# EasyEDA Pro project ProPrj_多功能方向盘_2025-05-18.epro, schematic Schematic1
Board Name: Board1; Create Date: 2025-04-27; Page Name: P1; Project Name: 多功能方向盘; Schematic Name: Schematic1; Update Date: 2025-04-27; Company: 嘉立创EDA; Page Size: A4; Version: V1.0
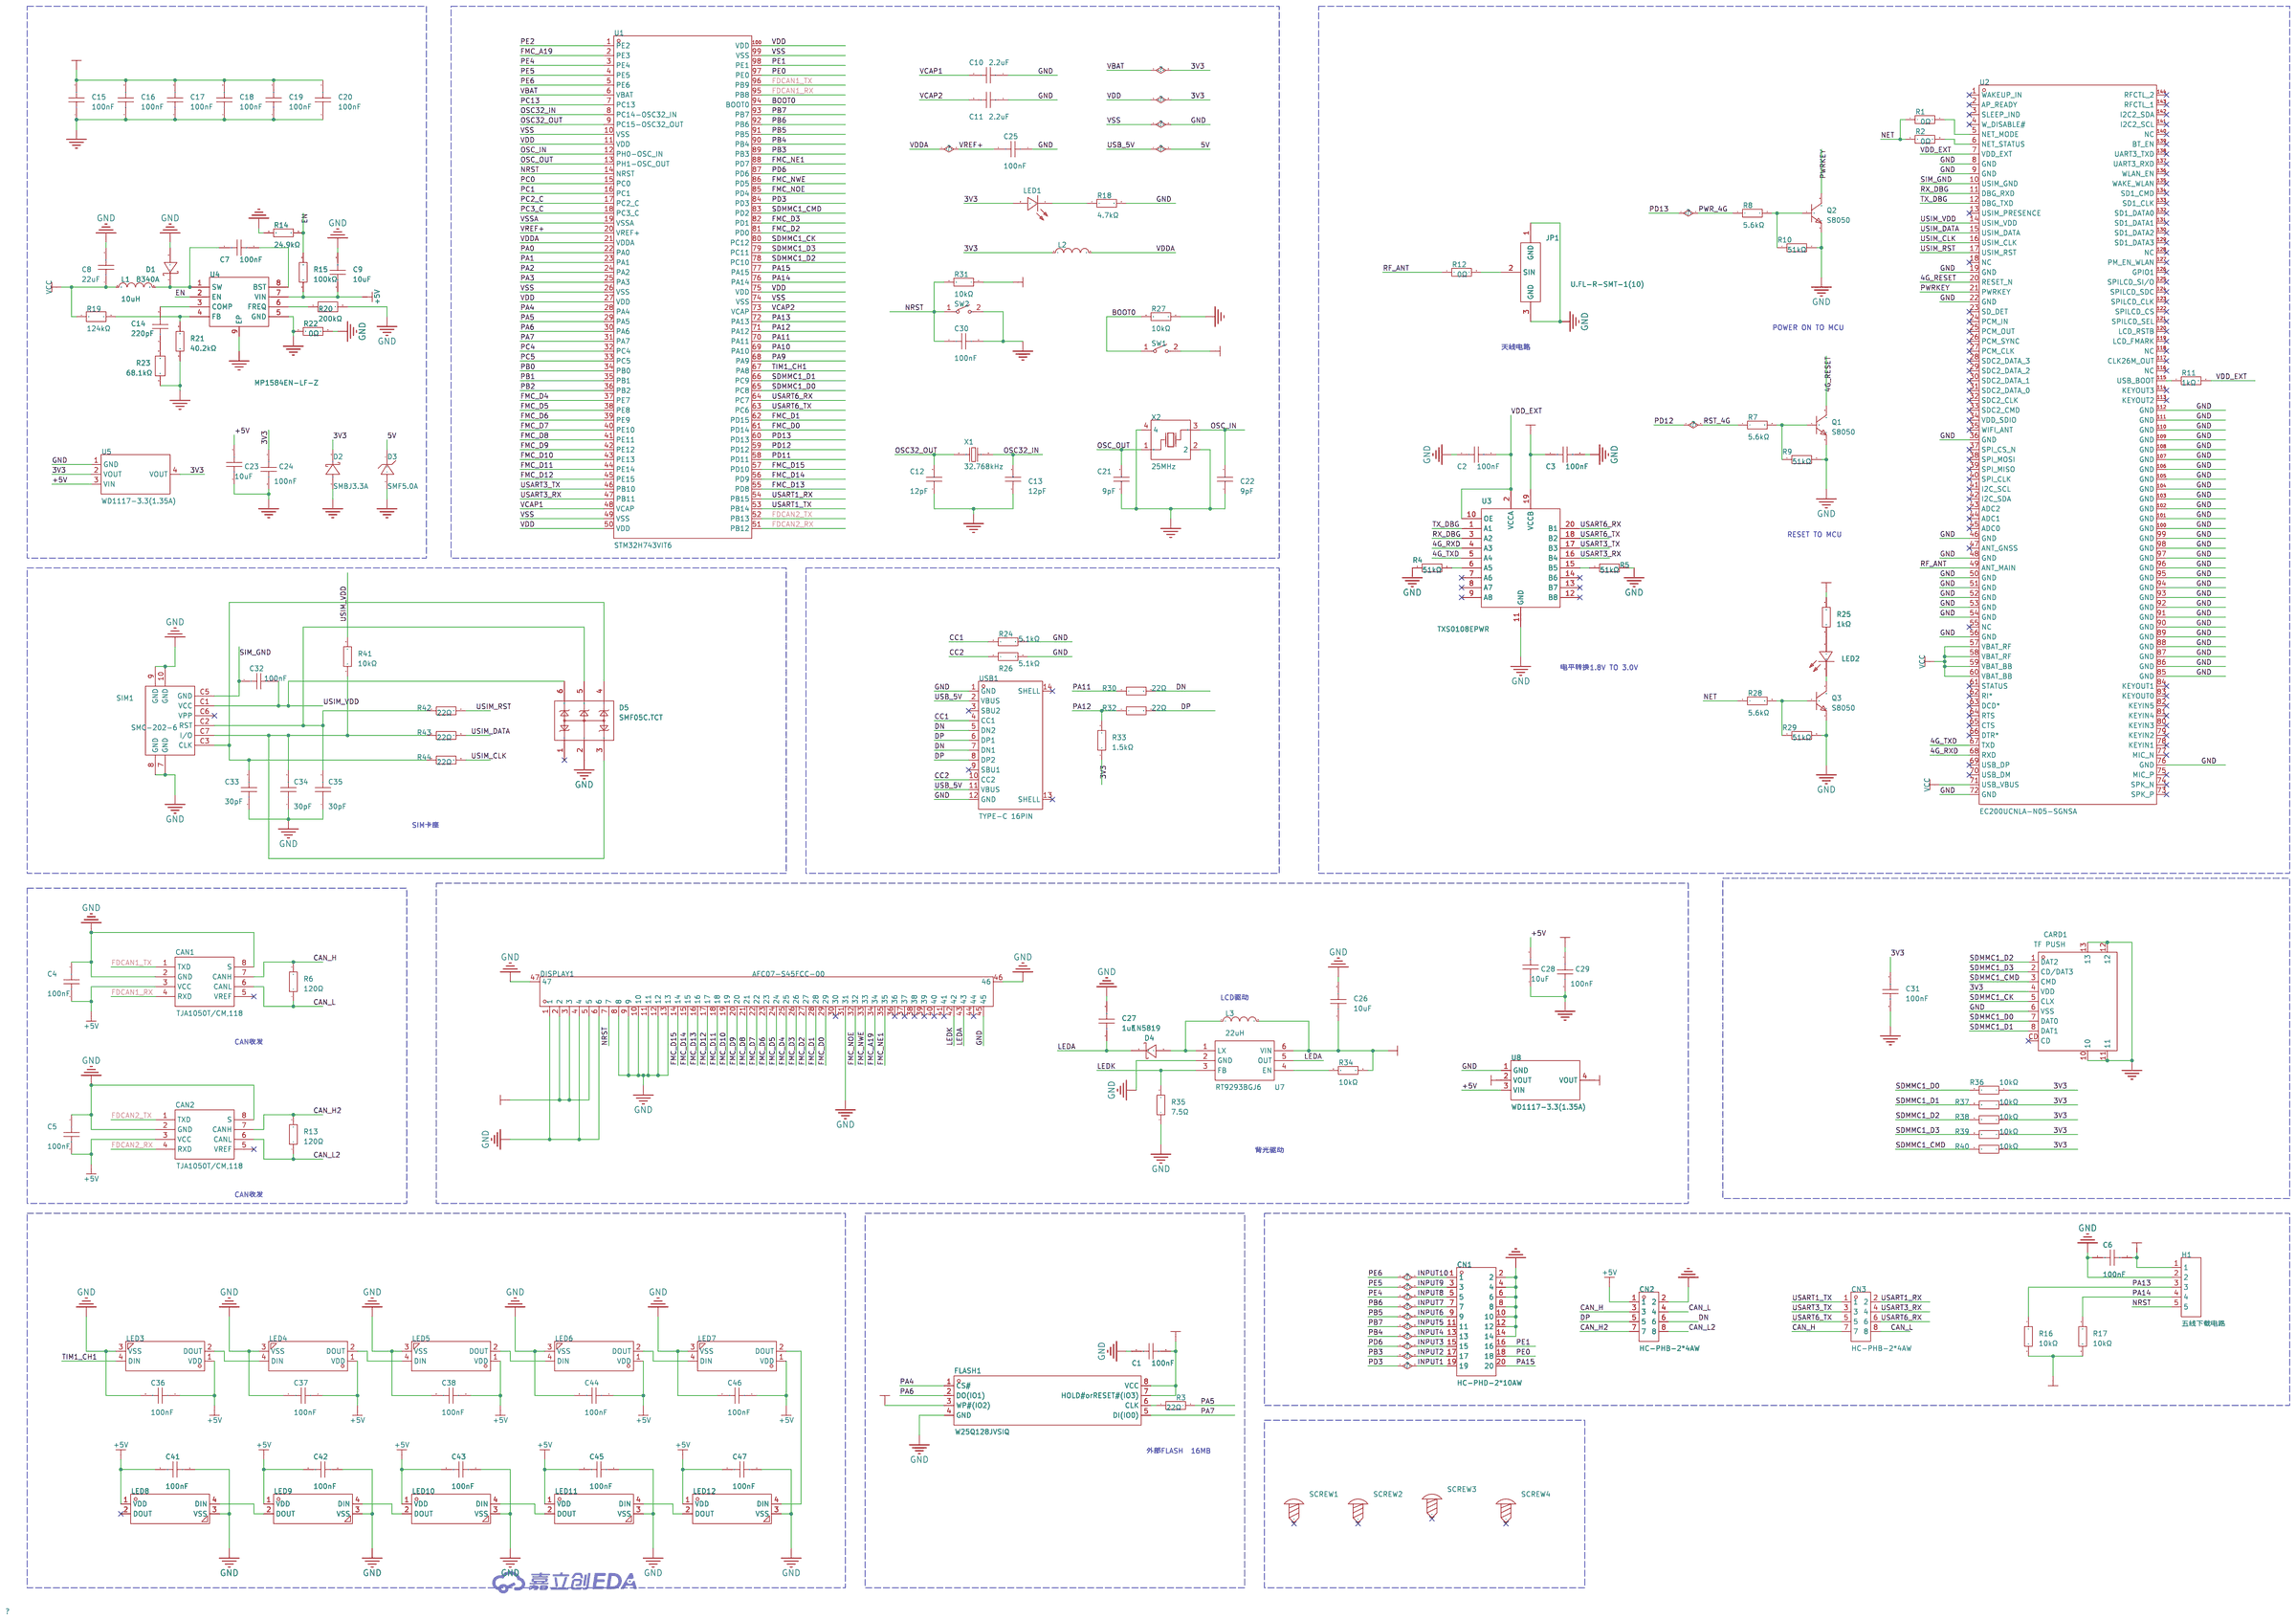
[diagram p0: schematic sheet]

## Parts
C1  100nF  [C0402]
C2  100nF  [C0402]
C3  100nF  [C0402]
C4  100nF  [C0402]
C5  100nF  [C0402]
C6  100nF  [C0402]
C7  100nF  [C0402]
C8  22uF  [C0603]
C9  10uF  [C0603]
C10  2.2uF  [C0402]
C11  2.2uF  [C0402]
C12  12pF  [C0402]
C13  12pF  [C0402]
C14  220pF  [C0402]
C15  100nF  [C0402]
C16  100nF  [C0402]
C17  100nF  [C0402]
C18  100nF  [C0402]
C19  100nF  [C0402]
C20  100nF  [C0402]
C21  9pF  [C0402]
C22  9pF  [C0402]
C23  10uF  [C0603]
C24  100nF  [C0402]
C25  100nF  [C0402]
C26  10uF  [C0603]
C27  1uF  [C0402]
C28  10uF  [C0603]
C29  100nF  [C0402]
C30  100nF  [C0402]
C31  100nF  [C0402]
C32  100nF  [C0402]
C33  30pF  [C0402]
C34  30pF  [C0402]
C35  30pF  [C0402]
C36  100nF  [C0402]
C37  100nF  [C0402]
C38  100nF  [C0402]
C41  100nF  [C0402]
C42  100nF  [C0402]
C43  100nF  [C0402]
C44  100nF  [C0402]
C45  100nF  [C0402]
C46  100nF  [C0402]
C47  100nF  [C0402]
CAN1  TJA1050T/CM,118  [SOIC-8_L5.0-W4.0-P1.27-LS6.0-BL]
CAN2  TJA1050T/CM,118  [SOIC-8_L5.0-W4.0-P1.27-LS6.0-BL]
CARD1  TF PUSH  [TF-SMD_TF-PUSH]
CN1  HC-PHD-2*10AW  [CONN-TH_20P-P2.00_HCTL_HC-PHD]
CN2  HC-PHB-2*4AW  [CONN-TH_8P-P2.00_HCTL_HC-PHB-2X4AW]
CN3  HC-PHB-2*4AW  [CONN-TH_8P-P2.00_HCTL_HC-PHB-2X4AW]
D1  B340A  [SMA_L4.3-W2.6-LS5.1-RD]
D2  SMBJ3.3A  [SMB_L4.4-W3.6-LS5.3-R-RD]
D3  SMF5.0A  [SOD-123FL_L2.8-W1.9-LS3.7-RD]
D4  1N5819  [SMA_L4.4-W2.6-LS5.0-RD]
D5  SMF05C.TCT  [SC-70-6_L2.2-W1.3-P0.65-LS2.1-BR]
DISPLAY1  AFC07-S45FCC-00  [FPC-SMD_45P-P0.50_SLIDE-LOCK-BOTTOM-CONTACT]
FLASH1  W25Q128JVSIQ  [SOIC-8_L5.3-W5.3-P1.27-LS8.0-BL]
H1  五线下载电路  [HDR-TH_5P-P2.00-H-M_2005WR-5P]
JP1  U.FL-R-SMT-1(10)  [ANT-SMD_UFL-R-SMT-1-10]
L1  10uH  [IND-SMD_L4.0-W4.0]
L2  BLM15PD121SN1D  [L0402]
L3  22uH  [IND-SMD_L5.0-W5.0_H4.0]
LED1  NCD0402R1  [LED0402-RD]
LED2  NCD0402R1  [LED0402-RD]
LED3  WS2812B-B  [LED-SMD_4P-L5.0-W5.0-TL_WS2812B-B]
LED4  WS2812B-B  [LED-SMD_4P-L5.0-W5.0-TL_WS2812B-B]
LED5  WS2812B-B  [LED-SMD_4P-L5.0-W5.0-TL_WS2812B-B]
LED6  WS2812B-B  [LED-SMD_4P-L5.0-W5.0-TL_WS2812B-B]
LED7  WS2812B-B  [LED-SMD_4P-L5.0-W5.0-TL_WS2812B-B]
LED8  WS2812B-B  [LED-SMD_4P-L5.0-W5.0-TL_WS2812B-B]
LED9  WS2812B-B  [LED-SMD_4P-L5.0-W5.0-TL_WS2812B-B]
LED10  WS2812B-B  [LED-SMD_4P-L5.0-W5.0-TL_WS2812B-B]
LED11  WS2812B-B  [LED-SMD_4P-L5.0-W5.0-TL_WS2812B-B]
LED12  WS2812B-B  [LED-SMD_4P-L5.0-W5.0-TL_WS2812B-B]
Q1  S8050  [SOT-23-3_L2.9-W1.3-P1.90-LS2.4-BR]
Q2  S8050  [SOT-23-3_L2.9-W1.3-P1.90-LS2.4-BR]
Q3  S8050  [SOT-23-3_L2.9-W1.3-P1.90-LS2.4-BR]
R1  0Ω  [R0402]
R2  0Ω  [R0402]
R3  22Ω  [R0402]
R4  51kΩ  [R0402]
R5  51kΩ  [R0402]
R6  120Ω  [R0402]
R7  5.6kΩ  [R0402]
R8  5.6kΩ  [R0402]
R9  51kΩ  [R0402]
R10  51kΩ  [R0402]
R11  1kΩ  [R0402]
R12  0Ω  [R0402]
R13  120Ω  [R0402]
R14  24.9kΩ  [R0402]
R15  100kΩ  [R0402]
R16  10kΩ  [R0402]
R17  10kΩ  [R0402]
R18  4.7kΩ  [R0402]
R19  124kΩ  [R0402]
R20  200kΩ  [R0402]
R21  40.2kΩ  [R0402]
R22  0Ω  [R0402]
R23  68.1kΩ  [R0402]
R24  5.1kΩ  [R0402]
R25  1kΩ  [R0402]
R26  5.1kΩ  [R0402]
R27  10kΩ  [R0402]
R28  5.6kΩ  [R0402]
R29  51kΩ  [R0402]
R30  22Ω  [R0402]
R31  10kΩ  [R0402]
R32  22Ω  [R0402]
R33  1.5kΩ  [R0402]
R34  10kΩ  [R0402]
R35  7.5Ω  [R0402]
R36  10kΩ  [R0402]
R37  10kΩ  [R0402]
R38  10kΩ  [R0402]
R39  10kΩ  [R0402]
R40  10kΩ  [R0402]
R41  10kΩ  [R0402]
R42  22Ω  [R0402]
R43  22Ω  [R0402]
R44  22Ω  [R0402]
SCREW1  -  [M3螺丝]
SCREW2  -  [M3螺丝]
SCREW3  -  [M3螺丝]
SCREW4  -  [M3螺丝]
SIM1  SMC-202-6  [SIM-SMD_SMC-202-6]
SW1  TS-1088R-02026  [SW-SMD_L3.9-W3.0-P4.45]
SW2  TS-1088R-02026  [SW-SMD_L3.9-W3.0-P4.45]
U1  STM32H743VIT6  [LQFP-100_L14.0-W14.0-P0.50-LS16.0-BL]
U2  EC200UCNLA-N05-SGNSA  [LCC-LGA-144_L31.0-W28.0-P1.30_L610-CN-02]
U3  TXS0108EPWR  [TSSOP-20_L6.5-W4.4-P0.65-LS6.4-BL]
U4  MP1584EN-LF-Z  [SOIC-8_L5.0-W4.0-P1.27-LS6.0-BL-EP2.0]
U5  WD1117-3.3(1.35A)  [SOT-223-3_L6.5-W3.4-P2.30-LS7.0-BR]
U7  -  [SOT-23-6_L2.9-W1.6-P0.95-LS2.8-BR]
U8  WD1117-3.3(1.35A)  [SOT-223-3_L6.5-W3.4-P2.30-LS7.0-BR]
USB1  TYPE-C 16PIN  [USB-C-SMD_TYPE-C-6PIN-2MD-073]
X1  32.768kHz  [FC-135R_L3.2-W1.5]
X2  25MHz  [CRYSTAL-SMD_4P-L3.2-W2.5-BL]

## Library data of the parts
C1-C7 C15-C20 C24 C25 C29-C32 C36-C38 C41-C47 = CL05B104KO5NNNC: 容值:100nF;精度:±10%;额定电压:16V;材质(温度系数):X7R;; LCSC Part Name: 100nF ±10% 16V; Supplier Part: C1525; Manufacturer: SAMSUNG(三星); Supplier Footprint: 0402; JLCPCB Part Class: 基础库; Datasheet: https://atta.szlcsc.com/upload/public/pdf/source/20160218/1457707763339.pdf; Supplier: LCSC; Tolerance: ±10%; Voltage Rated: 16V; Temperature Coefficient: X7R
C8 = CGA0603X5R226M160JT: 容值:22uF;精度:±20%;额定电压:16V;材质(温度系数):X5R;; LCSC Part Name: 22uF ±20% 16V; Supplier Part: C6119868; Manufacturer: HRE(芯声); Supplier Footprint: 0603; JLCPCB Part Class: 扩展库; Supplier: LCSC; Tolerance: ±20%; Voltage Rated: 16V; Temperature Coefficient: X5R
C9 C23 C26 C28 = CGA0603X5R106K100JT: 容值:10uF;精度:±10%;额定电压:10V;材质(温度系数):X5R;; LCSC Part Name: 10uF ±10% 10V; Supplier Part: C6119842; Manufacturer: HRE(芯声); Supplier Footprint: 0603; JLCPCB Part Class: 扩展库; Supplier: LCSC; Tolerance: ±10%; Voltage Rated: 10V; Temperature Coefficient: X5R
C10 C11 = CL05A225KO5NQNC: 容值:2.2uF;精度:±10%;额定电压:16V;材质(温度系数):X5R;; LCSC Part Name: 2.2uF ±10% 16V; Supplier Part: C170151; Manufacturer: SAMSUNG(三星); Supplier Footprint: 0402; JLCPCB Part Class: 扩展库; Datasheet: https://atta.szlcsc.com/upload/public/pdf/source/20160218/1457707763339.pdf; Supplier: LCSC; Tolerance: ±10%; Voltage Rated: 16V; Temperature Coefficient: X5R
C12 C13 = GRM1555C1H120JA01D: 容值:12pF;精度:±5%;额定电压:50V;材质(温度系数):C0G;; LCSC Part Name: 12pF ±5% 50V; Supplier Part: C76948; Manufacturer: muRata(村田); Supplier Footprint: 0402; JLCPCB Part Class: 扩展库; Datasheet: https://atta.szlcsc.com/upload/public/pdf/source/20180307/C76948_15204091175261407736.pdf; Supplier: LCSC; Tolerance: ±5%; Voltage Rated: 50V; Temperature Coefficient: C0G
C14 = GRM1555C1H221JA01D: 容值:220pF;精度:±5%;额定电压:50V;材质(温度系数):C0G;; LCSC Part Name: 220pF ±5% 50V; Supplier Part: C71693; Manufacturer: muRata(村田); Supplier Footprint: 0402; JLCPCB Part Class: 扩展库; Datasheet: https://atta.szlcsc.com/upload/public/pdf/source/20161108/1478586451181.pdf; Supplier: LCSC; Tolerance: ±5%; Voltage Rated: 50V; Temperature Coefficient: C0G
C21 C22 = 0402CG9R0C500NT: 容值:9pF;额定电压:50V;温度系数:C0G;; LCSC Part Name: ±0.25pF 9pF 50V; Supplier Part: C1580; Manufacturer: FH(风华); Supplier Footprint: 0402; JLCPCB Part Class: 扩展库; Datasheet: https://atta.szlcsc.com/upload/public/pdf/source/20200305/C486355_26A10D38EF8C2A5C37091D0039909270.pdf; Supplier: LCSC; Voltage Rating: 50V; Temperature Coefficient: C0G
C27 = CL05A105KA5NQNC: 容值:1uF;精度:±10%;额定电压:25V;材质(温度系数):X5R;; LCSC Part Name: 1uF ±10% 25V; Supplier Part: C52923; Manufacturer: SAMSUNG(三星); Supplier Footprint: 0402; JLCPCB Part Class: 基础库; Datasheet: https://atta.szlcsc.com/upload/public/pdf/source/20160218/1457707763339.pdf; Supplier: LCSC; Tolerance: ±10%; Voltage Rated: 25V; Temperature Coefficient: X5R
C33-C35 = GCQ1555C1H300JB01D: 容值:30pF;精度:±5%;额定电压:50V;材质(温度系数):-;; LCSC Part Name: 30pF ±5% 50V; Supplier Part: C2186903; Manufacturer: muRata(村田); Supplier Footprint: 0402; JLCPCB Part Class: 扩展库; Datasheet: https://atta.szlcsc.com/upload/public/pdf/source/20210612/66FBFE1CC3D0A6F34E2515C814489E64.pdf; Supplier: LCSC; Tolerance: ±5%; Voltage Rated: 50V
CAN1 CAN2 = TJA1050T/CM,118: 类型:收发器;协议类别:CAN总线;; Supplier Part: C6952; Manufacturer: NXP(恩智浦); Supplier Footprint: SOIC-8_150mil; JLCPCB Part Class: Basic Part; Datasheet: https://atta.szlcsc.com/upload/public/pdf/source/20140411/1457707042917.pdf; Supplier: LCSC; Type: 收发器; Protocol: CAN总线; Supply Voltage: 4.75V ~ 5.25V
CARD1 = TF PUSH: 卡连接方式:自弹式;卡类型:MicroSD卡(TF卡);连接器类型:卡座;本体最大高度:2mm;工作温度范围:-20℃~+90℃;; LCSC Part Name: 自弹式 MicroSD卡(TF卡) 卡座; Supplier Part: C393941; Manufacturer: SHOU HAN(首韩); Supplier Footprint: SMD; JLCPCB Part Class: 扩展库; Datasheet: https://atta.szlcsc.com/upload/public/pdf/source/20191011/C393941_0DDD896EE907FEB750D8B7B8982E2A67.pdf; Supplier: LCSC; Card Connection Mode: 自弹式; Card Type: MicroSD卡(TF卡); Connector Type: 卡座; Maximum Body Height: 2mm; Operating Temperature Range: -20℃~+90℃
CN1 = HC-PHD-2*10AW: 插针结构:2x10P;间距:2mm;安装方式:弯插;参考系列:PHD;总PIN数:20P;排数:2;每排PIN数:10;行距:2mm;额定电流:3A;触头材质:黄铜;触头镀层:锡;工作温度范围:-25℃~+85℃;; LCSC Part Name: 2x10P 间距:2mm 弯插 系列:PHD; Supplier Part: C2845639; Manufacturer: HCTL(华灿天禄); Supplier Footprint: 弯插,P=2mm; JLCPCB Part Class: 扩展库; Datasheet: https://atta.szlcsc.com/upload/public/pdf/source/20240826/7E3B459B81463944AEE37CAD48063E32.pdf; Supplier: LCSC; Pins Structure: 2x10P; Pitch: 2mm; Mounting Style: 弯插; Reference Series: PHD; Number of Pins: 20P; Number of Rows: 2; Number of PINs Per Row: 10; Row Spacing: 2mm; Current Rating (Max): 3A; Contact Material: 黄铜; Contact Plating: 锡; Operating Temperature Range: -25℃~+85℃; Rated Voltage (Max): 250V; Plastic Material: PA46; Z-Height of the Board: 5.2mm; X-Length of Bottom Edge on Board (Spacing Line): 22mm; Y-Width of Bottom Edge on Board: 9.5mm
CN2 CN3 = HC-PHB-2*4AW: 插针结构:2x4P;间距:2mm;安装方式:弯插;参考系列:-;总PIN数:8P;排数:2;每排PIN数:4;行距:2mm;额定电流:2A;触头材质:黄铜;触头镀层:锡;工作温度范围:-40℃~+105℃;; LCSC Part Name: 2x4P 间距:2mm 弯插; Supplier Part: C2845898; Manufacturer: HCTL(华灿天禄); Supplier Footprint: 弯插,P=2mm; JLCPCB Part Class: 扩展库; Datasheet: https://atta.szlcsc.com/upload/public/pdf/source/20241107/C3FDF6F4E6440F0C633ABF41B12F454C.pdf; Supplier: LCSC; Pins Structure: 2x4P; Pitch: 2mm; Mounting Style: 弯插; Number of Pins: 8P; Number of Rows: 2; Number of PINs Per Row: 4; Row Spacing: 2mm; Current Rating (Max): 2A; Contact Material: 黄铜; Contact Plating: 锡; Operating Temperature Range: -40℃~+105℃; Rated Voltage (Max): 250V; Plastic Material: PA66; Z-Height of the Board: 7.3mm; X-Length of Bottom Edge on Board (Spacing Line): 10mm
D1 = B340A: 二极管配置:独立式;正向压降(Vf):550mV@3A;直流反向耐压(Vr):40V;整流电流:3A;; LCSC Part Name: 电压:40V 电流:3A; Supplier Part: C64982; Manufacturer: MDD(辰达半导体); Supplier Footprint: SMA(DO-214AC); JLCPCB Part Class: 扩展库; Datasheet: https://atta.szlcsc.com/upload/public/pdf/source/20240710/591710C3B34CDB7FE3DA92C119E6F598.pdf; Supplier: LCSC; Diode Configuration: 独立式; Forward Voltage (Vf@If): 550mV@3A; Reverse Voltage (Vr): 40V; Rectified Current: 3A; Reverse Leakage Current (Ir): 500uA@40V
D2 = SMBJ24A_C726830: 极性：单向 反向截止电压(Vrwm)：24V 击穿电压：26.7V 最大钳位电压：38.9V; LCSC Part Name: SMBJ24A; Supplier Part: C726830; Manufacturer: TWGMC(台湾迪嘉); Supplier Footprint: SMB; JLCPCB Part Class: 扩展库; Datasheet: https://atta.szlcsc.com/upload/public/pdf/source/20200901/C726811_07201DC3516E92FF13903A0BAE18F725.pdf; Supplier: LCSC
D3 = SMF5.0A_C2857263: 反向截止电压(Vrwm):5V;最大钳位电压:9.2V;峰值脉冲电流(Ipp)@10/1000us:21.7A;击穿电压:6.4V;; Supplier Part: C2857263; Manufacturer: JSMSEMI(杰盛微); Supplier Footprint: SOD-123FL; JLCPCB Part Class: 扩展库; Datasheet: https://atta.szlcsc.com/upload/public/pdf/source/20220120/4066B4D37095FB947F97BAEB950D8525.pdf; Supplier: LCSC; Reverse Stand-Off Voltage (Vrwm): 5V; Maximum Clamping Voltage: 9.2V; Peak Pulse Current (Ipp)@10/1000us: 21.7A; Breakdown Voltage: 6.4V; Reverse Leakage Current (Ir): 2uA
D4 = 1N5819: 直流反向耐压(Vr):40V;平均整流电流(Io):1A;正向压降(Vf):500mV@1A;; LCSC Part Name: 40V 1A 500mV@1A; Supplier Part: C437199; Manufacturer: KEXIN(科信); Supplier Footprint: SMA; JLCPCB Part Class: Extended Part; Datasheet: https://atta.szlcsc.com/upload/public/pdf/source/20191012/C437199_83583E622A6684E767605E43C169C596.pdf; Supplier: LCSC; Reverse Voltage (Vr): 40V; Average Rectified Current (Io): 1A; Forward Voltage (Vf@If): 500mV@1A
D5 = SMF05C.TCT: 反向截止电压(Vrwm):5V@Max;击穿电压(最小值):6V;最大钳位电压:12.5V;; LCSC Part Name: Vrwm：5V@Max; Supplier Part: C85191; Manufacturer: SEMTECH; Supplier Footprint: SC-70-6(SOT-363); JLCPCB Part Class: Extended Part; Datasheet: https://atta.szlcsc.com/upload/public/pdf/source/20170704/1499151379189.pdf; Supplier: LCSC; Reverse Stand-Off Voltage (Vrwm): 5V@Max; Breakdown Voltage (Min): 6V; Maximum Clamping Voltage: 12.5V
DISPLAY1 = AFC07-S45FCC-00: 间距:0.5mm;触点数量:45;锁定特性:抽屉式;安装类型:卧贴;触点类型:上接;; LCSC Part Name: 0.5mm P数:45 抽屉式 下接; Supplier Part: C53058; Manufacturer: JS(钜硕电子); Supplier Footprint: SMD,P=0.5mm; JLCPCB Part Class: Extended Part; Datasheet: https://atta.szlcsc.com/upload/public/pdf/source/20151024/1457707491270.pdf; Supplier: LCSC; Pitch: 0.5mm; Number of Contacts: 45; Locking Feature: 抽屉式; Mounting Type: 卧贴; Contact Type: 下接; Height Above Board: 2mm; FFC, FCB Thickness: 0.3mm
FLASH1 = W25Q128JVSIQ_C113767: Supplier Part: C113767; Manufacturer: WINBOND(华邦); Supplier Footprint: SOIC-8-208mil; JLCPCB Part Class: Extended Part; Datasheet: https://atta.szlcsc.com/upload/public/pdf/source/20180329/C113767_097B64D788F6E3FFB2E9CB46CB6C1427.pdf; Supplier: LCSC
H1 = HC-PZ200-10.5L-1x5PWA: 插针结构:1x5P;间距:2mm;行距:-;圆针/方针:方针;安装方式:弯插;排数:单排;总PIN位数:5P;额定电流:1.5A;额定电压:-;配合针长度:4mm;塑高:2mm;端接针长度:2.8mm;触头材质:黄铜;触头镀层:金;工作温度:-40℃~+105℃;颜色:黑色;; LCSC Part Name: 1x5P 间距:2mm 方针 弯插; Supplier Part: C22373834; Manufacturer: HC(虹成电子); Supplier Footprint: 弯插,P=2mm; JLCPCB Part Class: 扩展库; Datasheet: https://atta.szlcsc.com/upload/public/pdf/source/20250106/B188A63B8DBD12FDD50FFA8EDDC02E69.pdf; Supplier: LCSC; Pin Structure: 1x5P; Pitch: 2mm; Circluar Pins/Square Pins: 方针; Mounting Type: 弯插; Number of Rows: 单排; Number of Pins: 5P; Current Rating: 1.5A; Length of Mating Pin: 4mm; Insulation Height: 2mm; Length of End Connection Pin: 2.8mm; Contact Material: 黄铜; Contact Plating: 金; Operating Temperature: -40℃~+105℃; Color: 黑色
JP1 = U.FL-R-SMT-1(10): 连接器类型:板端;射频系列:IPEX;接口类型:内针;端口数量:1;阻抗:50Ω;频率-最大值:6GHz;样式:-;接口直径:2mm;接口长度/高度:1.25mm;工作温度范围:-40~+90;; LCSC Part Name: IPEX 内针; Supplier Part: C88373; Manufacturer: HRS(广濑); Supplier Footprint: SMD; JLCPCB Part Class: Extended Part; Datasheet: https://atta.szlcsc.com/upload/public/pdf/source/20170116/1484561244841.pdf; Supplier: LCSC; Connector Type: 板端; RF Series: IPEX; Interface Type: 内针; Number of Ports: 1; Impedance: 50Ω; Frequency-Max: 6GHz; Interface Diameter: 2mm; Interface Length/Height: 1.25mm; Operating Temperature Range: -40~+90
L1 = FHD4020S-100MT: 电感值:10uH;精度:±20%;额定电流:2.35A;饱和电流(Isat):3.5A;; LCSC Part Name: 10uH ±20% 3.5A; Supplier Part: C602032; Manufacturer: cjiang(长江微电); Supplier Footprint: SMD,4x4mm; JLCPCB Part Class: 扩展库; Datasheet: https://atta.szlcsc.com/upload/public/pdf/source/20200609/C601990_BCEA243EC4DA0A9A288AA78A6DFB48A5.pdf; Supplier: LCSC; Tolerance: ±20%; Rated Current: 2.35A; Saturation Current (Isat): 3.5A; DC Resistance (DCR): 190mΩ
L2 = BLM15PD121SN1D: 标称阻抗@测试频率:120Ω@100MHz;误差:±25%;直流电阻(RDC):90mΩ;; LCSC Part Name: 单路 0402磁珠 阻抗120Ω@100MHz; Supplier Part: C76891; Manufacturer: muRata(村田); Supplier Footprint: 0402; JLCPCB Part Class: 扩展库; Datasheet: https://atta.szlcsc.com/upload/public/pdf/source/20181120/C333978_3E581FB55966932B05020139ABDE8E01.pdf; Supplier: LCSC; Impedance @ Frequency: 120Ω@100MHz; Tolerance: ±25%; DC Resistance: 90mΩ; Current Rating: 1.3A; Circuits: 1
L3 = FNR5040S220MT: 电感值:22uH;精度:±20%;额定电流:1.6A;饱和电流(Isat):1.8A;类型:磁胶屏蔽绕线合金电感;; LCSC Part Name: 22uH ±20% 1.8A; Supplier Part: C167971; Manufacturer: cjiang(长江微电); Supplier Footprint: SMD,5x5mm; JLCPCB Part Class: 扩展库; Datasheet: https://atta.szlcsc.com/upload/public/pdf/source/20190327/C167925_9EFF0AABC4CA629C2CC95961DBF7D39D.pdf; Supplier: LCSC; Tolerance: ±20%; Current Rating: 1.6A; Current - Saturation(Isat): 1.8A; DC Resistance(DCR): 168mΩ; Type: 磁胶屏蔽绕线合金电感
LED1 LED2 = NCD0402R1: 发光颜色:红色;正向电压(VF):1.6V~2.6V;功率:65mW;正向电流:5mA;主波长:615nm~635nm;透镜颜色:无色透明透镜;发光强度:13mcd~30mcd;发光角度:130°;工作温度:-30℃~+85℃;; Supplier Part: C130719; Manufacturer: 国星光电; Supplier Footprint: 0402; JLCPCB Part Class: 扩展库; Datasheet: https://atta.szlcsc.com/upload/public/pdf/source/20200820/C130719_A72EA5A7FEC83C35856EA0453E4EE775.pdf; Supplier: LCSC; Emitted Color: 红色; Forward Voltage (VF): 1.6V~2.6V; Power Dissipation: 65mW; Forward Current: 5mA; Dominant Wavelength: 615nm~635nm; Lens Color: 无色透明透镜; Luminous Intensity: 13mcd~30mcd; Viewing Angle: 130°; Operating Temperature: -30℃~+85℃
LED3-LED12 = WS2812B-B: 发光颜色:RGB三色;; LCSC Part Name: RGB三色 （注意防潮，请查阅规格书中对应具体内容）; Supplier Part: C114586; Manufacturer: worldsemi; Supplier Footprint: 5050(mm); JLCPCB Part Class: Extended Part; Datasheet: https://atta.szlcsc.com/upload/public/pdf/source/20200615/C114586_26EB6813EC9F2A3F6C7FBB2AD75DE01F.pdf; Supplier: LCSC; Emitted Color: RGB三色
Q1-Q3 = S8050_C2891804: 晶体管类型:NPN;集电极电流(Ic):500mA;集射极击穿电压(Vceo):25V;耗散功率(Pd):300mW;直流电流增益(hFE):400@50mA,1V;; Supplier Part: C2891804; Manufacturer: YONGYUTAI(永裕泰); Supplier Footprint: SOT-23; JLCPCB Part Class: 扩展库; Datasheet: https://atta.szlcsc.com/upload/public/pdf/source/20210901/5347316A10609C628D4D69AE01446E5B.pdf; Supplier: LCSC; type: NPN; Current - Collector(Ic): 500mA; Collector - Emitter Voltage VCEO: 25V; Pd - Power Dissipation: 300mW; DC Current Gain: 400@50mA,1V; Current - Collector Cutoff: 1uA; Vce Saturation(VCE(sat)): 500mV
R1 R2 R12 R22 = 0402WGF0000TCE: 电阻类型:厚膜电阻;阻值:0Ω;精度:±1%;功率:62.5mW;最大工作电压:50V;温度系数:±800ppm/℃;; LCSC Part Name: 0Ω ±1% 62.5mW 厚膜电阻; Supplier Part: C17168; Manufacturer: UNI-ROYAL(厚声); Supplier Footprint: 0402; JLCPCB Part Class: 基础库; Datasheet: https://atta.szlcsc.com/upload/public/pdf/source/20200306/C422600_1E6D84923E4A46A82E41ADD87F860B5C.pdf; Supplier: LCSC; Type: 厚膜电阻; Tolerance: ±1%; Power(Watts): 62.5mW; Overload Voltage (Max): 50V; Temperature Coefficient: ±800ppm/℃; Operating Temperature Range: -55℃~+155℃
R3 R30 R32 R42-R44 = 0402WGF220JTCE: 电阻类型:厚膜电阻;阻值:22Ω;精度:±1%;功率:62.5mW;最大工作电压:50V;温度系数:±100ppm/℃;; LCSC Part Name: 22Ω ±1% 62.5mW 厚膜电阻; Supplier Part: C25092; Manufacturer: UNI-ROYAL(厚声); Supplier Footprint: 0402; JLCPCB Part Class: 基础库; Datasheet: https://atta.szlcsc.com/upload/public/pdf/source/20200306/C422600_1E6D84923E4A46A82E41ADD87F860B5C.pdf; Supplier: LCSC; Type: 厚膜电阻; Tolerance: ±1%; Power(Watts): 62.5mW; Overload Voltage (Max): 50V; Temperature Coefficient: ±100ppm/℃; Operating Temperature Range: -55℃~+155℃
R4 R5 R9 R10 R29 = 0402WGF5102TCE: 电阻类型:厚膜电阻;阻值:51kΩ;精度:±1%;功率:62.5mW;最大工作电压:50V;温度系数:±100ppm/℃;; LCSC Part Name: 51kΩ ±1% 62.5mW 厚膜电阻; Supplier Part: C25794; Manufacturer: UNI-ROYAL(厚声); Supplier Footprint: 0402; JLCPCB Part Class: 基础库; Datasheet: https://atta.szlcsc.com/upload/public/pdf/source/20200306/C422600_1E6D84923E4A46A82E41ADD87F860B5C.pdf; Supplier: LCSC; Type: 厚膜电阻; Tolerance: ±1%; Power(Watts): 62.5mW; Overload Voltage (Max): 50V; Temperature Coefficient: ±100ppm/℃; Operating Temperature Range: -55℃~+155℃
R6 R13 = RC0402FR-07120RL: 电阻类型:厚膜电阻;阻值:120Ω;精度:±1%;功率:62.5mW;最大工作电压:50V;温度系数:±100ppm/℃;; LCSC Part Name: 厚膜电阻 120Ω ±1% 62.5mW; Supplier Part: C114758; Manufacturer: YAGEO(国巨); Supplier Footprint: 0402; JLCPCB Part Class: 扩展库; Datasheet: https://atta.szlcsc.com/upload/public/pdf/source/20180821/C275644_0D56F95EFF785E7D9A1FEF436B37DA78.pdf; Supplier: LCSC; Type: 厚膜电阻; Tolerance: ±1%; Power(Watts): 62.5mW; Overload Voltage (Max): 50V; Temperature Coefficient: ±100ppm/℃; Operating Temperature Range: -55℃~+155℃
R7 R8 R28 = RC0402FR-075K6L: 电阻类型:厚膜电阻;阻值:5.6kΩ;精度:±1%;功率:62.5mW;最大工作电压:50V;温度系数:±100ppm/℃;; LCSC Part Name: 厚膜电阻 5.6kΩ ±1% 62.5mW; Supplier Part: C163457; Manufacturer: YAGEO(国巨); Supplier Footprint: 0402; JLCPCB Part Class: 扩展库; Datasheet: https://atta.szlcsc.com/upload/public/pdf/source/20181009/C309620_DA5935B6E1D48212CB7A533FE518B3C2.pdf; Supplier: LCSC; Type: 厚膜电阻; Tolerance: ±1%; Power(Watts): 62.5mW; Overload Voltage (Max): 50V; Temperature Coefficient: ±100ppm/℃; Operating Temperature Range: -55℃~+155℃
R11 R25 = 0402WGF1001TCE: 电阻类型:厚膜电阻;阻值:1kΩ;精度:±1%;功率:62.5mW;最大工作电压:50V;温度系数:±100ppm/℃;; LCSC Part Name: 1kΩ ±1% 62.5mW 厚膜电阻; Supplier Part: C11702; Manufacturer: UNI-ROYAL(厚声); Supplier Footprint: 0402; JLCPCB Part Class: 基础库; Datasheet: https://atta.szlcsc.com/upload/public/pdf/source/20200306/C422600_1E6D84923E4A46A82E41ADD87F860B5C.pdf; Supplier: LCSC; Type: 厚膜电阻; Tolerance: ±1%; Power(Watts): 62.5mW; Overload Voltage (Max): 50V; Temperature Coefficient: ±100ppm/℃; Operating Temperature Range: -55℃~+155℃
R14 = 0402WGF2492TCE: 电阻类型:厚膜电阻;阻值:24.9kΩ;精度:±1%;功率:62.5mW;最大工作电压:50V;温度系数:±100ppm/℃;; LCSC Part Name: 24.9kΩ ±1% 62.5mW 厚膜电阻; Supplier Part: C25874; Manufacturer: UNI-ROYAL(厚声); Supplier Footprint: 0402; JLCPCB Part Class: 扩展库; Datasheet: https://atta.szlcsc.com/upload/public/pdf/source/20200306/C422600_1E6D84923E4A46A82E41ADD87F860B5C.pdf; Supplier: LCSC; Type: 厚膜电阻; Tolerance: ±1%; Power(Watts): 62.5mW; Overload Voltage (Max): 50V; Temperature Coefficient: ±100ppm/℃; Operating Temperature Range: -55℃~+155℃
R15 = 0402WGF1003TCE: 电阻类型:厚膜电阻;阻值:100kΩ;精度:±1%;功率:62.5mW;最大工作电压:50V;温度系数:±100ppm/℃;; LCSC Part Name: 100kΩ ±1% 62.5mW 厚膜电阻; Supplier Part: C25741; Manufacturer: UNI-ROYAL(厚声); Supplier Footprint: 0402; JLCPCB Part Class: 基础库; Datasheet: https://atta.szlcsc.com/upload/public/pdf/source/20200306/C422600_1E6D84923E4A46A82E41ADD87F860B5C.pdf; Supplier: LCSC; Type: 厚膜电阻; Tolerance: ±1%; Power(Watts): 62.5mW; Overload Voltage (Max): 50V; Temperature Coefficient: ±100ppm/℃; Operating Temperature Range: -55℃~+155℃
R16 R17 R27 R31 R34 R36-R41 = 0402WGF1002TCE: 电阻类型:厚膜电阻;阻值:10kΩ;精度:±1%;功率:62.5mW;最大工作电压:50V;温度系数:±100ppm/℃;; LCSC Part Name: 10kΩ ±1% 62.5mW 厚膜电阻; Supplier Part: C25744; Manufacturer: UNI-ROYAL(厚声); Supplier Footprint: 0402; JLCPCB Part Class: 基础库; Datasheet: https://atta.szlcsc.com/upload/public/pdf/source/20200306/C422600_1E6D84923E4A46A82E41ADD87F860B5C.pdf; Supplier: LCSC; Type: 厚膜电阻; Tolerance: ±1%; Power(Watts): 62.5mW; Overload Voltage (Max): 50V; Temperature Coefficient: ±100ppm/℃; Operating Temperature Range: -55℃~+155℃
R18 = 0402WGF4701TCE: 电阻类型:厚膜电阻;阻值:4.7kΩ;精度:±1%;功率:62.5mW;最大工作电压:50V;温度系数:±100ppm/℃;; LCSC Part Name: 4.7kΩ ±1% 62.5mW 厚膜电阻; Supplier Part: C25900; Manufacturer: UNI-ROYAL(厚声); Supplier Footprint: 0402; JLCPCB Part Class: 基础库; Datasheet: https://atta.szlcsc.com/upload/public/pdf/source/20200306/C422600_1E6D84923E4A46A82E41ADD87F860B5C.pdf; Supplier: LCSC; Type: 厚膜电阻; Tolerance: ±1%; Power(Watts): 62.5mW; Overload Voltage (Max): 50V; Temperature Coefficient: ±100ppm/℃; Operating Temperature Range: -55℃~+155℃
R19 = FRC0402F1243TS: 电阻类型:厚膜电阻;阻值:124kΩ;精度:±1%;功率:62.5mW;最大工作电压:50V;温度系数:±100ppm/℃;; LCSC Part Name: 124kΩ ±1% 62.5mW 厚膜电阻; Supplier Part: C2933070; Manufacturer: FOJAN(富捷); Supplier Footprint: 0402; JLCPCB Part Class: 扩展库; Datasheet: https://atta.szlcsc.com/upload/public/pdf/source/20211221/925EC7D7225764EE0046F22065062C87.pdf; Supplier: LCSC; Type: 厚膜电阻; Tolerance: ±1%; Power(Watts): 62.5mW; Overload Voltage (Max): 50V; Temperature Coefficient: ±100ppm/℃; Operating Temperature Range: -55℃~+155℃
R20 = FRC0402F2003TS: 电阻类型:厚膜电阻;阻值:200kΩ;精度:±1%;功率:62.5mW;工作电压:50V;温度系数:±100ppm/℃;; LCSC Part Name: 200kΩ ±1% 62.5mW 厚膜电阻; Supplier Part: C2906866; Manufacturer: FOJAN(富捷); Supplier Footprint: 0402; JLCPCB Part Class: 扩展库; Datasheet: https://atta.szlcsc.com/upload/public/pdf/source/20211221/925EC7D7225764EE0046F22065062C87.pdf; Supplier: LCSC; Type: 厚膜电阻; Tolerance: ±1%; Power(Watts): 62.5mW; Voltage-Supply(Max): 50V; Temperature Coefficient: ±100ppm/℃; Operating Temperature: -55℃~+155℃
R21 = 0402WGF4022TCE: 电阻类型:厚膜电阻;阻值:40.2kΩ;精度:±1%;功率:62.5mW;最大工作电压:50V;温度系数:±100ppm/℃;; LCSC Part Name: 40.2kΩ ±1% 62.5mW 厚膜电阻; Supplier Part: C25893; Manufacturer: UNI-ROYAL(厚声); Supplier Footprint: 0402; JLCPCB Part Class: 扩展库; Datasheet: https://atta.szlcsc.com/upload/public/pdf/source/20200306/C422600_1E6D84923E4A46A82E41ADD87F860B5C.pdf; Supplier: LCSC; Type: 厚膜电阻; Tolerance: ±1%; Power(Watts): 62.5mW; Overload Voltage (Max): 50V; Temperature Coefficient: ±100ppm/℃; Operating Temperature Range: -55℃~+155℃
R23 = FRC0402F6812TS: 电阻类型:厚膜电阻;阻值:68.1kΩ;精度:±1%;功率:62.5mW;最大工作电压:50V;温度系数:±100ppm/℃;; LCSC Part Name: 68.1kΩ ±1% 62.5mW 厚膜电阻; Supplier Part: C3013185; Manufacturer: FOJAN(富捷); Supplier Footprint: 0402; JLCPCB Part Class: 扩展库; Datasheet: https://atta.szlcsc.com/upload/public/pdf/source/20211221/925EC7D7225764EE0046F22065062C87.pdf; Supplier: LCSC; Type: 厚膜电阻; Tolerance: ±1%; Power(Watts): 62.5mW; Overload Voltage (Max): 50V; Temperature Coefficient: ±100ppm/℃
R24 R26 = 0402WGF5101TCE: 电阻类型:厚膜电阻;阻值:5.1kΩ;精度:±1%;功率:62.5mW;最大工作电压:50V;温度系数:±100ppm/℃;; LCSC Part Name: 5.1kΩ ±1% 62.5mW 厚膜电阻; Supplier Part: C25905; Manufacturer: UNI-ROYAL(厚声); Supplier Footprint: 0402; JLCPCB Part Class: 基础库; Datasheet: https://atta.szlcsc.com/upload/public/pdf/source/20200306/C422600_1E6D84923E4A46A82E41ADD87F860B5C.pdf; Supplier: LCSC; Type: 厚膜电阻; Tolerance: ±1%; Power(Watts): 62.5mW; Overload Voltage (Max): 50V; Temperature Coefficient: ±100ppm/℃; Operating Temperature Range: -55℃~+155℃
R33 = 0402WGF1501TCE: 电阻类型:厚膜电阻;阻值:1.5kΩ;精度:±1%;功率:62.5mW;最大工作电压:50V;温度系数:±100ppm/℃;; LCSC Part Name: 1.5kΩ ±1% 62.5mW 厚膜电阻; Supplier Part: C25867; Manufacturer: UNI-ROYAL(厚声); Supplier Footprint: 0402; JLCPCB Part Class: 基础库; Datasheet: https://atta.szlcsc.com/upload/public/pdf/source/20200306/C422600_1E6D84923E4A46A82E41ADD87F860B5C.pdf; Supplier: LCSC; Type: 厚膜电阻; Tolerance: ±1%; Power(Watts): 62.5mW; Overload Voltage (Max): 50V; Temperature Coefficient: ±100ppm/℃; Operating Temperature Range: -55℃~+155℃
R35 = CR0402-J/-7R5GLF: 电阻类型:厚膜电阻;阻值:7.5Ω;精度:±5%;功率:62.5mW;温度系数:-200ppm/℃~+500ppm/℃;; LCSC Part Name: 厚膜电阻 7.5Ω ±5% 62.5mW; Supplier Part: C203096; Manufacturer: BOURNS; Supplier Footprint: 0402; JLCPCB Part Class: 扩展库; Datasheet: https://atta.szlcsc.com/upload/public/pdf/source/20181212/C203209_F068E534E77134F920D773BDEFB0EE77.pdf; Supplier: LCSC; Type: 厚膜电阻; Tolerance: ±5%; Power(Watts): 62.5mW; Temperature Coefficient: -200ppm/℃~+500ppm/℃; Operating Temperature Range: -55℃~+155℃
SCREW1-SCREW4 = M3螺丝: Supplier Footprint: 插件
SIM1 = SMC-202-6: 卡连接方式:自弹式;卡类型:MicroSIM卡;连接器类型:卡座;本体最大高度:1.35mm;触头材质:-;触头镀层:-;工作温度范围:-20~+60;; LCSC Part Name: 自弹式 MicroSIM卡 卡座 6P; Supplier Part: C266634; Manufacturer: XUNPU(讯普); Supplier Footprint: SMD; JLCPCB Part Class: Extended Part; Datasheet: https://atta.szlcsc.com/upload/public/pdf/source/20210906/4EE417A7320363AE91408A7279B36F10.pdf; Supplier: LCSC; Card Connection Mode: 自弹式; Card Type: MicroSIM卡; Connector Type: 卡座; Body Height (Max): 1.35mm; Operating Temperature Range: -20~+60
SW1 SW2 = TS-1088R-02026: 电路结构:单刀单掷;按钮形状:圆形按钮;安装方式:立贴;开关长度:3.9mm;开关宽度:2.93mm;开关高度:2mm;触点电流:50mA;额定电压(DC):12V;带灯:-;机械寿命:-;; LCSC Part Name: 3.9*2.93*2mm 立贴 轻触开关; Supplier Part: C455280; Manufacturer: XUNPU(讯普); Supplier Footprint: SMD,3x4mm; JLCPCB Part Class: 扩展库; Datasheet: https://atta.szlcsc.com/upload/public/pdf/source/20191118/C455281_EC5379764BC1462550DF64BBBFEA9579.pdf; Supplier: LCSC; Circuit: 单刀单掷; Actuator Style: 圆形按钮; Mounting Style: 立贴; Switch Length: 3.9mm; Switch Width: 2.93mm; Switch Height: 2mm; Contact Current: 50mA; Voltage Rating (DC): 12V
U1 = STM32H743VIT6_C114409: CPU内核:ARM-M系列;CPU最大主频:480MHz;应用领域:-;; LCSC Part Name: 带DSP和DP-FPU的高性能ARM Cortex-M7 MCU，具有2 MB Flash、1 MB RAM、480 MHz CPU、ART加速器、一级缓存、外部存储器接口和大量外设; Supplier Part: C114409; Manufacturer: ST(意法半导体); Supplier Footprint: LQFP-100(14x14); JLCPCB Part Class: 扩展库; Datasheet: https://atta.szlcsc.com/upload/public/pdf/source/20200508/C529058_DA70143F266D6D825C3A912656F12A87.pdf; Supplier: LCSC; CPU Core: ARM-M系列; CPU Maximum Speed: 480MHz; Program Storage Size: 2MB; Number of I/O: 82; ADC (Bit): 16bit; DAC (Bit): 12bit; Low Voltage Detection Threshold: 1.71V~3.6V
U2 = EC200UCNLA-N05-SGNSA: LCSC Part Name: LTE Cat 1模块; Supplier Part: C2916206; Manufacturer: Quectel(移远); Supplier Footprint: SMD,28x31mm; JLCPCB Part Class: 扩展库; Datasheet: https://atta.szlcsc.com/upload/public/pdf/source/20220309/3C2078D3551E384BF180A9D9DC9FCCD3.pdf; Supplier: LCSC
U3 = TXS0108EPWR: 转换器类型:电压电平;通道类型:双向;电路数:1;每个电路通道数:8;工作电压(VCCA):1.4V~3.6V;工作电压(VCCB):1.65V~5.5V;输入信号:-;输出信号:-;输出类型:开路漏极，推挽式;数据速率:60Mbps;工作温度:-40~+85;特性:自动方向检测;; Supplier Part: C17206; Manufacturer: TI(德州仪器); Supplier Footprint: TSSOP-20; JLCPCB Part Class: Extended Part; Datasheet: https://atta.szlcsc.com/upload/public/pdf/source/20140704/1457707111315.pdf; Supplier: LCSC; Translator Type: 电压电平; Channel Type: 双向; Number of Circuits: 1; Channels per Circuit: 8; Supply Voltage (VCCA): 1.4V~3.6V; Supply Voltage (VCCB): 1.65V~5.5V; Output Type: 开路漏极，推挽式; Data Rate: 60Mbps; Operating Temperature: -40~+85; Features: 自动方向检测
U4 = MP1584EN-LF-Z: 功能类型:降压型;输出类型:固定;工作电压:4.5V~28V;输出电压:800mV~25V;输出电流:3A;; LCSC Part Name: 3A、1.5MHz、28V降压转换器; Supplier Part: C15051; Manufacturer: MPS(芯源); Supplier Footprint: SOIC-8-EP; JLCPCB Part Class: 扩展库; Datasheet: https://atta.szlcsc.com/upload/public/pdf/source/20240315/437CA6FCECC7F1E554266F7D3B71CA0D.pdf; Supplier: LCSC; Function: 降压型; Output Type: 固定; Input Voltage: 4.5V~28V; Output Voltage: 800mV~25V; Output Current: 3A; Switching Frequency: 100kHz~1.5MHz; Operating Temperature: -20℃~+125℃; Synchronous Rectification: 否; Number of Outputs: 1; Topology: 降压式; Quiescent Current (Iq): 100uA; Switch tube (built-in/external): 内置
U5 U8 = WD1117-3.3(1.35A): 最大输入电压:15V;输出电压:3.3V;最大输出电流:1.35A;电源纹波抑制比(PSRR):70dB@(120Hz);; LCSC Part Name: 输入15V 输出3.3V 1.35A; Supplier Part: C5176020; Manufacturer: WD(维得）; Supplier Footprint: SOT-223; JLCPCB Part Class: Extended Part; Datasheet: https://atta.szlcsc.com/upload/public/pdf/source/20221129/C254C29D1CC02C49BD0B5CA72DD505A0.pdf; Supplier: LCSC; Maximum Input Voltage: 15V; Output Voltage: 3.3V; MAX Output Current: 1.35A; Power Supply Rejection Ratio (PSRR): 70dB@(120Hz); standby current: 4mA; Noise: 0.003%Vout; Operating Temperature: -40℃~+125℃; Output Type: 固定; Output Current: 1A; Dropout Voltage: 1.3V@(800mA); Output Polarity: 正; Number of Outputs: 1
U7 = RT9293BGJ6: 类型:-;拓扑结构:-;内部开关:-;供电电压（最低）:-;供电电压（最高）:-;频率:-;; Supplier Part: C36462; Manufacturer: RICHTEK(台湾立锜); Supplier Footprint: SOT-23-6; JLCPCB Part Class: Extended Part; Datasheet: https://atta.szlcsc.com/upload/public/pdf/source/20140924/1457707240143.pdf; Supplier: LCSC
USB1 = TYPE-C 16PIN 2MD(073): 连接器类型:Type-C;标准:-;公母:母;端口数量:1;触点数量:16P;安装方式:卧贴;额定电流 - 电源:5A;工作温度范围:-25℃~+85℃;; LCSC Part Name: Type-C 母 卧贴; Supplier Part: C2765186; Manufacturer: SHOU HAN(首韩); Supplier Footprint: SMD; JLCPCB Part Class: 扩展库; Datasheet: https://atta.szlcsc.com/upload/public/pdf/source/20211123/39B17C16241EAC15C5E277BDA434118E.pdf; Supplier: LCSC; Connector Type: Type-C; Gender: 母; Number of Ports: 1; Number of Contacts: 16P; Mounting Style: 卧贴; Current Rating - Power (Max): 5A; Operating Temperature Range: -25℃~+85℃
X1 = Q13FC1350000400: 频率:32.768kHz;负载电容:12.5pF;频率公差:±20ppm;; LCSC Part Name: 32.768kHz ±20ppm 12.5pF; Supplier Part: C32346; Manufacturer: EPSON(爱普生); Supplier Footprint: SMD3215-2P; JLCPCB Part Class: 基础库; Datasheet: https://atta.szlcsc.com/upload/public/pdf/source/20190108/C32346_746D6B07EAF90824457A96480007685F.pdf; Supplier: LCSC; Crystal Type: 贴片无源晶振; Load Capacitance: 12.5pF; Equivalent Series Resistance (ESR): 70kΩ; Frequency Tolerance: ±20ppm; Operating Temperature: -40℃~+85℃
X2 = S3226000151040: 频率:26MHz;负载电容:15pF;频率公差:±10ppm;; LCSC Part Name: 26MHz ±10ppm 15pF; Supplier Part: C479205; Manufacturer: JGHC(晶光华); Supplier Footprint: SMD3225-4P; JLCPCB Part Class: 扩展库; Datasheet: https://atta.szlcsc.com/upload/public/pdf/source/20230522/40D5BBD3CE23FDD9A2980F79514F1325.pdf; Supplier: LCSC; Crystal Type: 贴片无源晶振; Load Capacitance: 15pF; Equivalent Series Resistance (ESR): 40Ω; Frequency Tolerance: ±10ppm; Operating Temperature: -40℃~+85℃

## Nets
3V3: C1.2 C3.1 C6.2 C15.2 C16.2 C17.2 C18.2 C19.2 C20.2 C24.1 C31.1 CARD1.4(VDD) D2.2(K) FLASH1.3(WP#(IO2)) FLASH1.7(HOLD#orRESET#(IO3)) FLASH1.8(VCC) H1.1 L2.1 LED1.2(A) R16.2 R17.2 R25.2 R31.1 R33.1 R36.1 R37.1 R38.1 R39.1 R40.1 SW1.2 U1.6(VBAT) U1.11(VDD) U1.27(VDD) U1.50(VDD) U1.75(VDD) U1.100(VDD) U3.19(VCCB) U5.2(VOUT) U5.4(VOUT)
5V: D3.1(C) USB1.2(VBUS) USB1.11(VBUS)
+5V: C4.2 C5.2 C9.1 C23.2 C28.2 C36.1 C37.1 C38.1 C41.2 C42.2 C43.2 C44.1 C45.2 C46.1 C47.2 CAN1.3(VCC) CAN2.3(VCC) CN2.1 LED3.1(VDD) LED4.1(VDD) LED5.1(VDD) LED6.1(VDD) LED7.1(VDD) LED8.1(VDD) LED9.1(VDD) LED10.1(VDD) LED11.1(VDD) LED12.1(VDD) R15.1 U4.7(VIN) U5.3(VIN) U8.3(VIN)
GND: C1.1 C2.1 C3.2 C4.1 C5.1 C6.1 C8.2 C9.2 C10.1 C11.1 C12.1 C13.1 C15.1 C16.1 C17.1 C18.1 C19.1 C20.1 C21.1 C22.1 C23.1 C24.2 C25.1 C26.2 C27.2 C28.1 C29.2 C30.2 C31.2 C33.1 C34.1 C35.1 C36.2 C37.2 C38.2 C41.1 C42.1 C43.1 C44.2 C45.1 C46.2 C47.1 CAN1.2(GND) CAN1.8(S) CAN2.2(GND) CAN2.8(S) CARD1.6(VSS) CARD1.10 CARD1.11 CARD1.12 CARD1.13 CN1.2 CN1.4 CN1.6 CN1.8 CN1.10 CN1.12 CN1.14 CN2.2 D1.2(A) D2.1(A) D3.2(A) D5.2 DISPLAY1.1 DISPLAY1.4 DISPLAY1.6 DISPLAY1.8 DISPLAY1.9 DISPLAY1.10 DISPLAY1.11 DISPLAY1.12 DISPLAY1.13 DISPLAY1.31 DISPLAY1.45 DISPLAY1.46 DISPLAY1.47 FLASH1.4(GND) H1.2 JP1.1(GND) JP1.3(GND) LED3.3(VSS) LED4.3(VSS) LED5.3(VSS) LED6.3(VSS) LED7.3(VSS) LED8.3(VSS) LED9.3(VSS) LED10.3(VSS) LED11.3(VSS) LED12.3(VSS) Q1.2(E) Q2.2(E) Q3.2(E) R4.1 R5.2 R9.2 R10.2 R18.2 R20.2 R22.2 R24.2 R26.2 R27.1 R29.2 R35.1 SIM1.7(GND) SIM1.8(GND) SIM1.9(GND) SIM1.10(GND) SW2.2 U1.10(VSS) U1.26(VSS) U1.49(VSS) U1.74(VSS) U1.99(VSS) U2.8(GND) U2.9(GND) U2.19(GND) U2.22(GND) U2.36(GND) U2.46(GND) U2.48(GND) U2.50(GND) U2.51(GND) U2.52(GND) U2.53(GND) U2.54(GND) U2.56(GND) U2.72(GND) U2.76(GND) U2.85(GND) U2.86(GND) U2.87(GND) U2.88(GND) U2.89(GND) U2.90(GND) U2.91(GND) U2.92(GND) U2.93(GND) U2.94(GND) U2.95(GND) U2.96(GND) U2.97(GND) U2.98(GND) U2.99(GND) U2.100(GND) U2.101(GND) U2.102(GND) U2.103(GND) U2.104(GND) U2.105(GND) U2.106(GND) U2.107(GND) U2.108(GND) U2.109(GND) U2.110(GND) U2.111(GND) U2.112(GND) U3.11(GND) U5.1(GND) U7.2(GND) U8.1(GND) USB1.1(GND) USB1.12(GND) X2.2 X2.4
GND1: R14.1 R21.1 R22.1 R23.1 U4.5(GND) U4.9(EP)
VCC: C8.1 L1.1 R19.1 U2.57(VBAT_RF) U2.58(VBAT_RF) U2.59(VBAT_BB) U2.60(VBAT_BB) U2.71(USB_VBUS)
VCC_LCD: C26.1 C29.1 DISPLAY1.2 DISPLAY1.3 DISPLAY1.5 L3.2 R34.1 U7.6(VIN) U8.2(VOUT) U8.4(VOUT)
VDD_EXT: C2.2 R11.2 U2.7(VDD_EXT) U3.2(VCCA) U3.10(OE)
VDDA: C25.2 L2.2 U1.20(VREF+) U1.21(VDDA)
VSSA: U1.19(VSSA)
4G_RESET: Q1.3(C) U2.20(RESET_N)
4G_RXD: U2.68(RXD) U3.4(A3)
4G_TXD: U2.67(TXD) U3.5(A4)
BOOT0: R27.2 SW1.1 U1.94(BOOT0)
CAN_H: CAN1.7(CANH) CN2.3 CN3.7 R6.2
CAN_H2: CAN2.7(CANH) CN2.7 R13.2
CAN_L: CAN1.6(CANL) CN2.4 CN3.8 R6.1
CAN_L2: CAN2.6(CANL) CN2.8 R13.1
CC1: R24.1 USB1.4(CC1)
CC2: R26.1 USB1.10(CC2)
DN: CN2.6 R30.2 USB1.5(DN2) USB1.7(DN1)
DP: CN2.5 R32.2 USB1.6(DP1) USB1.8(DP2)
EN: R14.2 R15.2 U4.2(EN)
FDCAN1_RX: CAN1.4(RXD) U1.95(PB8)
FDCAN1_TX: CAN1.1(TXD) U1.96(PB9)
FDCAN2_RX: CAN2.4(RXD) U1.51(PB12)
FDCAN2_TX: CAN2.1(TXD) U1.52(PB13)
FMC_A19: DISPLAY1.34 U1.2(PE3)
FMC_D0: DISPLAY1.29 U1.61(PD14)
FMC_D1: DISPLAY1.28 U1.62(PD15)
FMC_D2: DISPLAY1.27 U1.81(PD0)
FMC_D3: DISPLAY1.26 U1.82(PD1)
FMC_D4: DISPLAY1.25 U1.37(PE7)
FMC_D5: DISPLAY1.24 U1.38(PE8)
FMC_D6: DISPLAY1.23 U1.39(PE9)
FMC_D7: DISPLAY1.22 U1.40(PE10)
FMC_D8: DISPLAY1.21 U1.41(PE11)
FMC_D9: DISPLAY1.20 U1.42(PE12)
FMC_D10: DISPLAY1.19 U1.43(PE13)
FMC_D11: DISPLAY1.18 U1.44(PE14)
FMC_D12: DISPLAY1.17 U1.45(PE15)
FMC_D13: DISPLAY1.16 U1.55(PD8)
FMC_D14: DISPLAY1.15 U1.56(PD9)
FMC_D15: DISPLAY1.14 U1.57(PD10)
FMC_NE1: DISPLAY1.35 U1.88(PD7)
FMC_NOE: DISPLAY1.32 U1.85(PD4)
FMC_NWE: DISPLAY1.33 U1.86(PD5)
INPUT1: CN1.19 U1.84(PD3)
INPUT2: CN1.17 U1.89(PB3)
INPUT3: CN1.15 U1.87(PD6)
INPUT4: CN1.13 U1.90(PB4)
INPUT5: CN1.11 U1.93(PB7)
INPUT6: CN1.9 U1.91(PB5)
INPUT7: CN1.7 U1.92(PB6)
INPUT8: CN1.5 U1.3(PE4)
INPUT9: CN1.3 U1.4(PE5)
INPUT10: CN1.1 U1.5(PE6)
LEDA: C27.1 D4.1(C) DISPLAY1.43 U7.5(OUT)
LEDK: DISPLAY1.42 R35.2 U7.3(FB)
NET: R1.1 R2.1 R28.1
NRST: C30.1 DISPLAY1.7 H1.5 R31.2 SW2.1 U1.14(NRST)
OSC32_IN: C13.2 U1.8(PC14-OSC32_IN) X1.2
OSC32_OUT: C12.2 U1.9(PC15-OSC32_OUT) X1.1
OSC_IN: C22.2 U1.12(PH0-OSC_IN) X2.3(OSC2)
OSC_OUT: C21.2 U1.13(PH1-OSC_OUT) X2.1(OSC1)
PA0: U1.22(PA0)
PA1: U1.23(PA1)
PA2: U1.24(PA2)
PA3: U1.25(PA3)
PA4: FLASH1.1(CS#) U1.28(PA4)
PA5: R3.2 U1.29(PA5)
PA6: FLASH1.2(DO(IO1)) U1.30(PA6)
PA7: FLASH1.5(DI(IO0)) U1.31(PA7)
PA9: U1.68(PA9)
PA10: U1.69(PA10)
PA11: R30.1 U1.70(PA11)
PA12: R32.1 R33.2 U1.71(PA12)
PA13: H1.3 R16.1 U1.72(PA13)
PA14: H1.4 R17.1 U1.76(PA14)
PA15: CN1.20 U1.77(PA15)
PB0: U1.34(PB0)
PB1: U1.35(PB1)
PB2: U1.36(PB2)
PC0: U1.15(PC0)
PC1: U1.16(PC1)
PC2_C: U1.17(PC2_C)
PC3_C: U1.18(PC3_C)
PC4: U1.32(PC4)
PC5: U1.33(PC5)
PC13: U1.7(PC13)
PD11: U1.58(PD11)
PD12: R7.1 U1.59(PD12)
PD13: R8.1 U1.60(PD13)
PE0: CN1.18 U1.97(PE0)
PE1: CN1.16 U1.98(PE1)
PE2: U1.1(PE2)
PWRKEY: Q2.3(C) U2.21(PWRKEY)
RF_ANT: R12.1 U2.49(ANT_MAIN)
RX_DBG: U2.11(DBG_RXD) U3.3(A2)
SDMMC1_CK: CARD1.5(CLX) U1.80(PC12)
SDMMC1_CMD: CARD1.3(CMD) R40.2 U1.83(PD2)
SDMMC1_D0: CARD1.7(DAT0) R36.2 U1.65(PC8)
SDMMC1_D1: CARD1.8(DAT1) R37.2 U1.66(PC9)
SDMMC1_D2: CARD1.1(DAT2) R38.2 U1.78(PC10)
SDMMC1_D3: CARD1.2(CD/DAT3) R39.2 U1.79(PC11)
SIM_GND: C32.1 SIM1.C5(GND) U2.10(USIM_GND)
TIM1_CH1: LED3.4(DIN) U1.67(PA8)
TX_DBG: U2.12(DBG_TXD) U3.1(A1)
USART1_RX: CN3.2 U1.54(PB15)
USART1_TX: CN3.1 U1.53(PB14)
USART3_RX: CN3.4 U1.47(PB11) U3.16(B4)
USART3_TX: CN3.3 U1.46(PB10) U3.17(B3)
USART6_RX: CN3.6 U1.64(PC7) U3.20(B1)
USART6_TX: CN3.5 U1.63(PC6) U3.18(B2)
USIM_CLK: R44.2 U2.16(USIM_CLK)
USIM_DATA: R43.2 U2.15(USIM_DATA)
USIM_RST: R42.2 U2.17(USIM_RST)
USIM_VDD: C32.2 D5.6 R41.2 SIM1.C1(VCC) U2.14(USIM_VDD)
VCAP1: C10.2 U1.48(VCAP)
VCAP2: C11.2 U1.73(VCAP)
$1N2746: LED1.1(K) R18.1
$1N7333: C33.2 D5.4 R44.1 SIM1.C3(CLK)
$1N7334: C34.2 D5.3 R41.1 R43.1 SIM1.C7(I/O)
$1N7335: C35.2 D5.5 R42.1 SIM1.C2(RST)
$1N11884: R4.2 U3.6(A5)
$1N11885: R5.1 U3.15(B5)
$1N12647: R11.1 U2.115(USB_BOOT)
$1N12652: R1.2 U2.5(NET_MODE)
$1N12653: R2.2 U2.6(NET_STATUS)
$1N12864: FLASH1.6(CLK) R3.1
$1N16034: JP1.2(SIN) R12.2
$1N16039: Q3.1(B) R28.2 R29.1
$1N16040: LED2.1(K) Q3.3(C)
$1N16049: Q1.1(B) R7.2 R9.1
$1N16052: Q2.1(B) R8.2 R10.1
$1N18895: C7.2 U4.8(BST)
$1N18896: C7.1 D1.1(K) L1.2 U4.1(SW)
$1N18899: C14.2 U4.3(COMP)
$1N18902: R19.2 R21.2 U4.4(FB)
$1N18907: R20.1 U4.6(FREQ)
$1N20475: R34.2 U7.4(EN)
$1N20534: D4.2(A) L3.1 U7.1(LX)
$1N21920: C14.1 R23.2
$1N22074: LED2.2(A) R25.1
$1N38583: LED5.2(DOUT) LED6.4(DIN)
$1N38584: LED4.2(DOUT) LED5.4(DIN)
$1N38585: LED3.2(DOUT) LED4.4(DIN)
$1N38586: LED10.4(DIN) LED11.2(DOUT)
$1N38587: LED9.4(DIN) LED10.2(DOUT)
$1N38588: LED8.4(DIN) LED9.2(DOUT)
$1N39276: LED6.2(DOUT) LED7.4(DIN)
$1N39277: LED7.2(DOUT) LED12.4(DIN)
$1N39279: LED11.4(DIN) LED12.2(DOUT)

Not connected (* = marked no-connect by the designer): CAN1 5(VREF)*; CAN2 5(VREF)*; CARD1 CD*; D5 1*; DISPLAY1 30* 36* 37* 38* 39* 40* 41* 44*; LED8 2(DOUT)*; SCREW1 1*; SCREW2 1*; SCREW3 1*; SCREW4 1*; SIM1 C6(VPP)*; U2 1(WAKEUP_IN)* 2(AP_READY)* 3(SLEEP_IND)* 4(W_DISABLE#)* 13(USIM_PRESENCE)* 18(NC)* 23(SD_DET)* 24(PCM_IN)* 25(PCM_OUT)* 26(PCM_SYNC)* 27(PCM_CLK)* 28(SDC2_DATA_3)* 29(SDC2_DATA_2)* 30(SDC2_DATA_1)* 31(SDC2_DATA_0)* 32(SDC2_CLK)* 33(SDC2_CMD)* 34(VDD_SDIO)* 35(WIFI_ANT)* 37(SPI_CS_N)* 38(SPI_MOSI)* 39(SPI_MISO)* 40(SPI_CLK)* 41(I2C_SCL)* 42(I2C_SDA)* 43(ADC2)* 44(ADC1)* 45(ADC0)* 47(ANT_GNSS)* 55(NC)* 61(STATUS)* 62(RI*)* 63(DCD*)* 64(RTS)* 65(CTS)* 66(DTR*)* 69(USB_DP)* 70(USB_DM)* 73(SPK_P)* 74(SPK_N)* 75(MIC_P)* 77(MIC_N)* 78(KEYIN1)* 79(KEYIN2)* 80(KEYIN3)* 81(KEYIN4)* 82(KEYIN5)* 83(KEYOUT0)* 84(KEYOUT1)* 113(KEYOUT2)* 114(KEYOUT3)* 116(NC)* 117(CLK26M_OUT)* 118(NC)* 119(LCD_FMARK)* 120(LCD_RSTB)* 121(SPILCD_SEL)* 122(SPILCD_CS)* 123(SPILCD_CLK)* 124(SPILCD_SDC)* 125(SPILCD_SI/O)* 126(GPIO1)* 127(PM_EN_WLAN)* 128(NC)* 129(SD1_DATA3)* 130(SD1_DATA2)* 131(SD1_DATA1)* 132(SD1_DATA0)* 133(SD1_CLK)* 134(SD1_CMD)* 135(WAKE_WLAN)* 136(WLAN_EN)* 137(UART3_RXD)* 138(UART3_TXD)* 139(BT_EN)* 140(NC)* 141(I2C2_SCL)* 142(I2C2_SDA)* 143(RFCTL_1)* 144(RFCTL_2)*; U3 7(A6)* 8(A7)* 9(A8)* 12(B8)* 13(B7)* 14(B6)*; USB1 3(SBU2)* 9(SBU1)* 13(SHELL)* 14(SHELL)*

## Notes on the sheet
- POWER ON TO MCU
- 天线电路
- RESET TO MCU
- 电平转换1.8V TO 3.0V
- SIM卡座
- LCD驱动
- CAN收发
- 背光驱动
- CAN收发
- 外部FLASH  16MB
